# EAGLE design pro-one-oscillators-with-connectors-version2 (EAGLE 5.07)
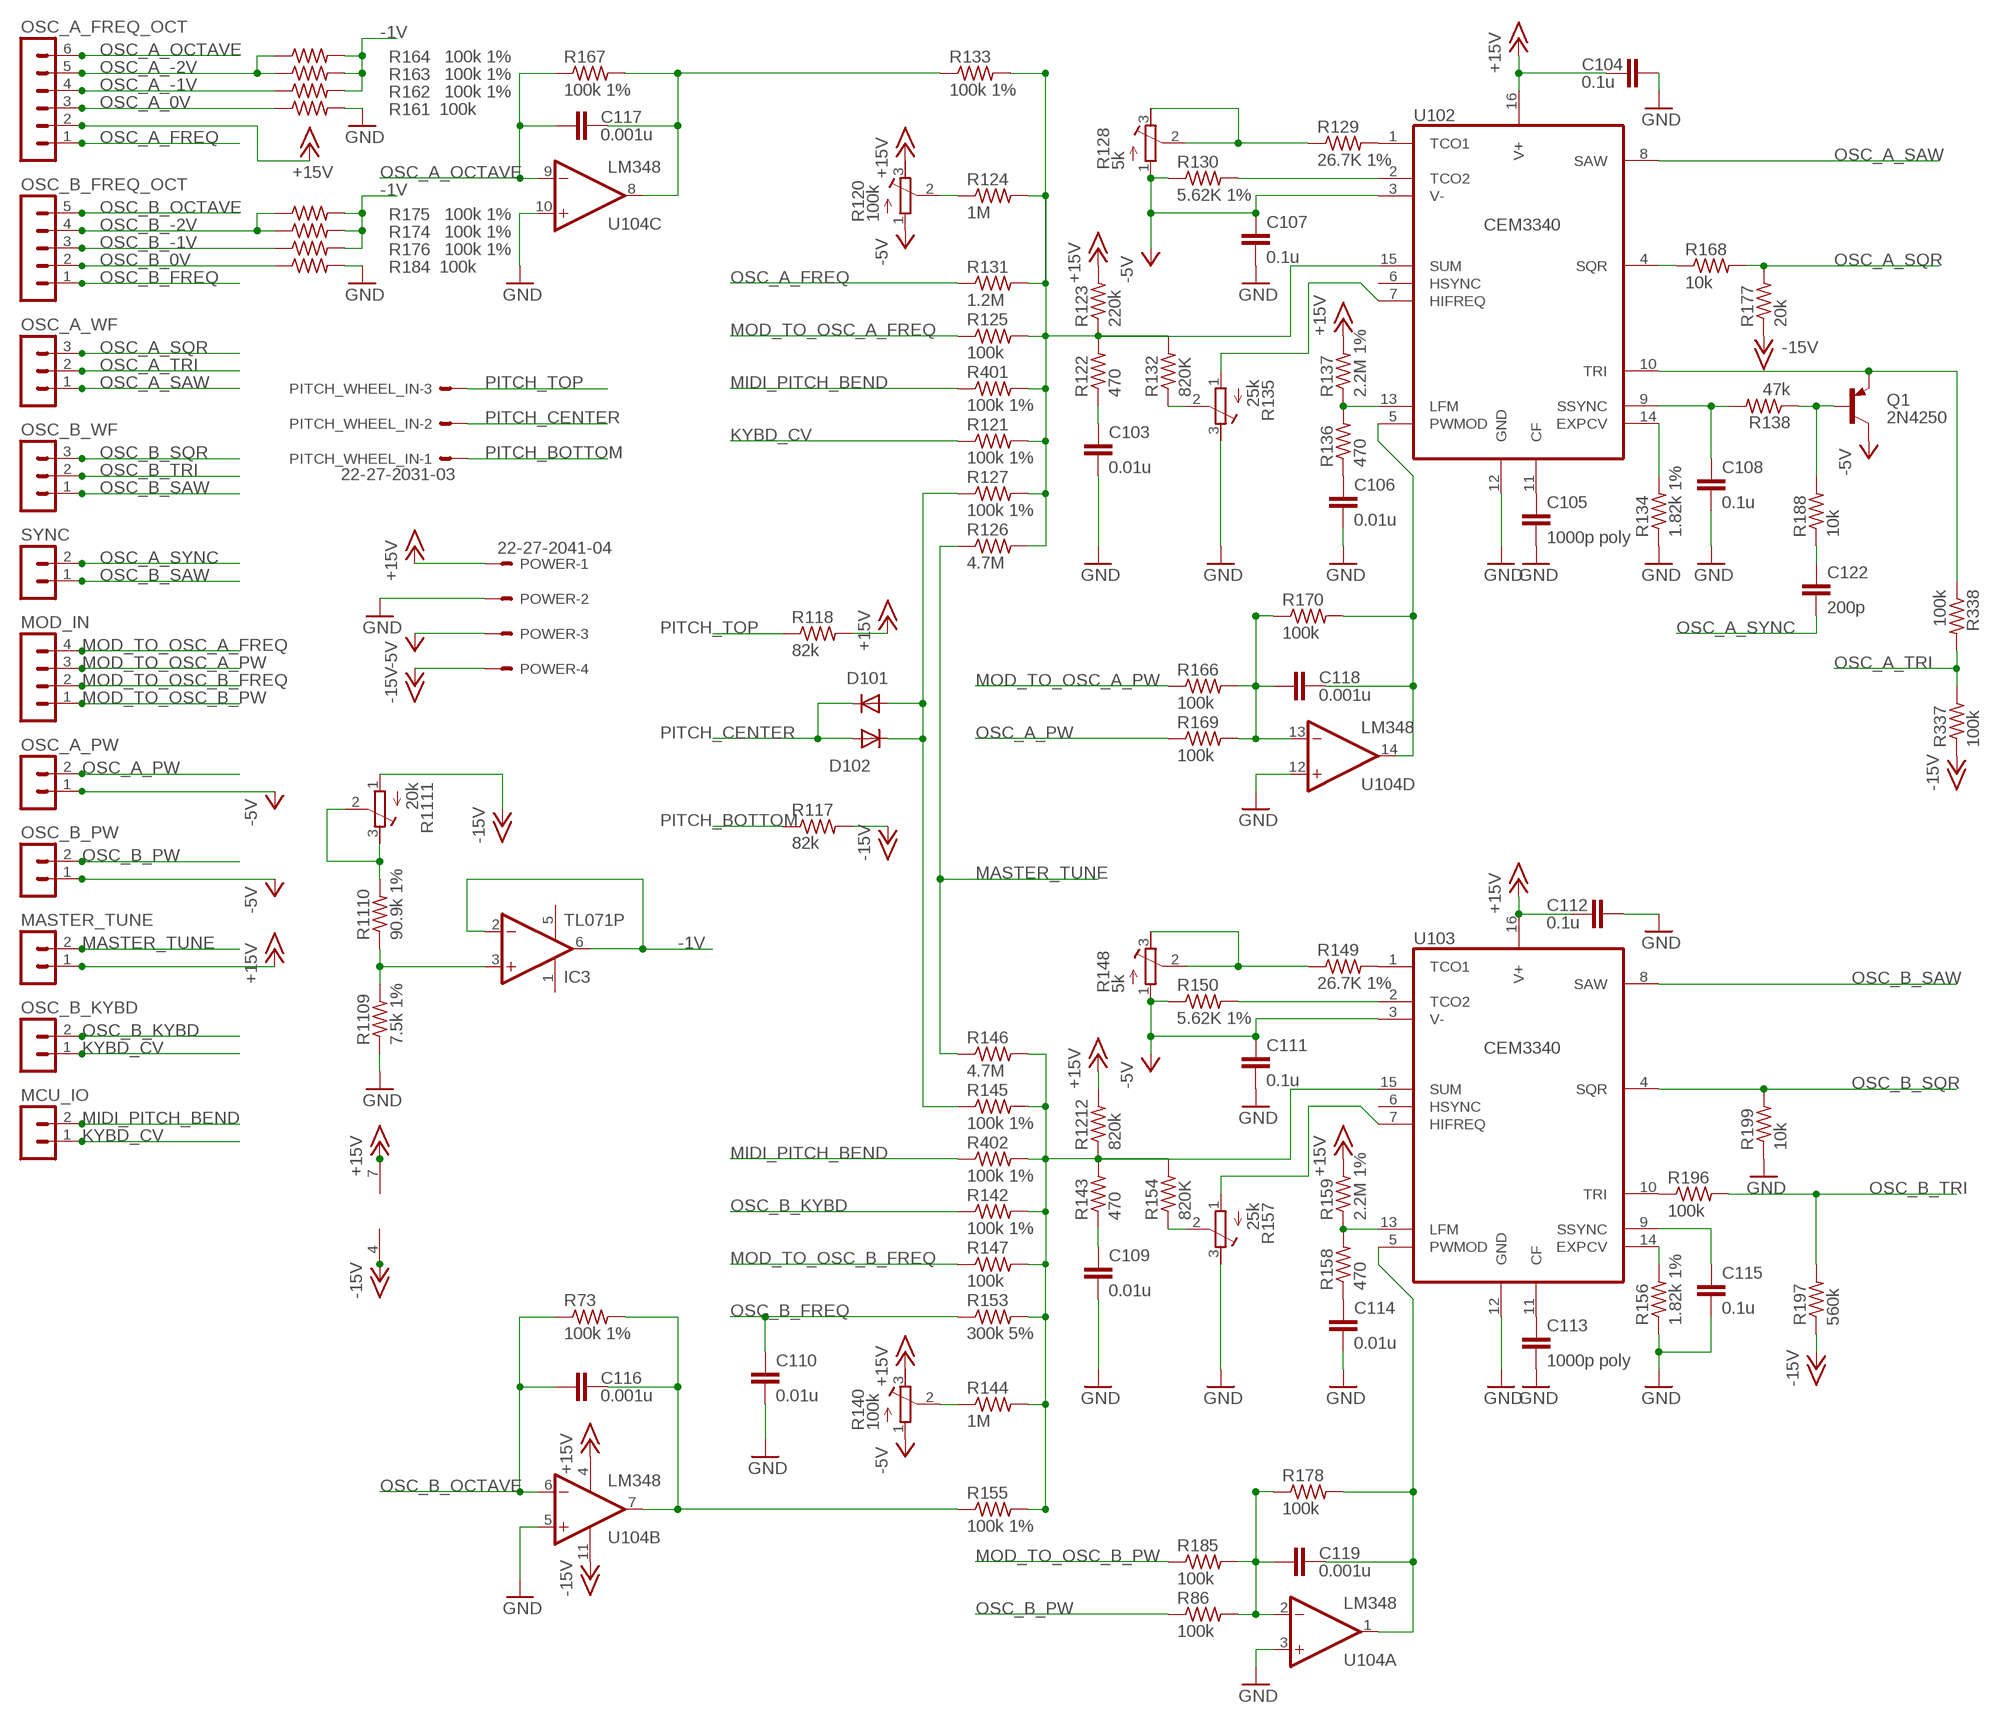
[diagram p0: schematic, sheet 1]

## Parts
C103  0.01u  C-EU050-025X075  [C050-025X075]
C104  0.1u  C-EU050-025X075  [C050-025X075]
C105  1000p poly  C-EU050-025X075  [C050-025X075]
C106  0.01u  C-EU050-025X075  [C050-025X075]
C107  0.1u  C-EU050-025X075  [C050-025X075]
C108  0.1u  C-EU050-025X075  [C050-025X075]
C109  0.01u  C-EU050-025X075  [C050-025X075]
C110  0.01u  C-EU050-025X075  [C050-025X075]
C111  0.1u  C-EU050-025X075  [C050-025X075]
C112  0.1u  C-EU050-025X075  [C050-025X075]
C113  1000p poly  C-EU050-025X075  [C050-025X075]
C114  0.01u  C-EU050-025X075  [C050-025X075]
C115  0.1u  C-EU050-025X075  [C050-025X075]
C116  0.001u  C-EU050-025X075  [C050-025X075]
C117  0.001u  C-EU050-025X075  [C050-025X075]
C118  0.001u  C-EU050-025X075  [C050-025X075]
C119  0.001u  C-EU050-025X075  [C050-025X075]
C122  200p  C-EU050-025X075  [C050-025X075]
D101  1N4148DO35-7  [DO35-7]
D102  1N4148DO35-7  [DO35-7]
IC3  TL071P  [DIL08]
MASTER_TUNE  MA02-1  [MA02-1]
MCU_IO  MA02-1  [MA02-1]
MOD_IN  MA04-1  [MA04-1]
OSC_A_FREQ_OCT  MA06-1  [MA06-1]
OSC_A_PW  MA02-1  [MA02-1]
OSC_A_WF  MA03-1  [MA03-1]
OSC_B_FREQ_OCT  MA05-1  [MA05-1]
OSC_B_KYBD  MA02-1  [MA02-1]
OSC_B_PW  MA02-1  [MA02-1]
OSC_B_WF  MA03-1  [MA03-1]
PITCH_WHEEL_IN  22-27-2031-03  [6410-03]
POWER  22-27-2041-04  [6410-04]
Q1  2N4250  [TO92]
R73  100k 1%  R-US_0309/10  [0309/10]
R86  100k  R-US_0309/10  [0309/10]
R117  82k  R-US_0309/10  [0309/10]
R118  82k  R-US_0309/10  [0309/10]
R120  100k  R-TRIMM64W  [RTRIM64W]
R121  100k 1%  R-US_0309/10  [0309/10]
R122  470  R-US_0309/10  [0309/10]
R123  220k  R-US_0309/10  [0309/10]
R124  1M  R-US_0309/10  [0309/10]
R125  100k  R-US_0309/10  [0309/10]
R126  4.7M  R-US_0309/10  [0309/10]
R127  100k 1%  R-US_0309/10  [0309/10]
R128  5k  R-TRIMM64W  [RTRIM64W]
R129  26.7K 1%  R-US_0309/10  [0309/10]
R130  5.62K 1%  R-US_0309/10  [0309/10]
R131  1.2M  R-US_0309/10  [0309/10]
R132  820K  R-US_0309/10  [0309/10]
R133  100k 1%  R-US_0309/10  [0309/10]
R134  1.82k 1%  R-US_0309/10  [0309/10]
R135  25k  R-TRIMM64W  [RTRIM64W]
R136  470  R-US_0309/10  [0309/10]
R137  2.2M 1%  R-US_0309/10  [0309/10]
R138  47k  R-US_0207/2V  [0207/2V]
R140  100k  R-TRIMM64W  [RTRIM64W]
R142  100k 1%  R-US_0309/10  [0309/10]
R143  470  R-US_0309/10  [0309/10]
R144  1M  R-US_0309/10  [0309/10]
R145  100k 1%  R-US_0207/2V  [0207/2V]
R146  4.7M  R-US_0309/10  [0309/10]
R147  100k  R-US_0309/10  [0309/10]
R148  5k  R-TRIMM64W  [RTRIM64W]
R149  26.7K 1%  R-US_0309/10  [0309/10]
R150  5.62K 1%  R-US_0309/10  [0309/10]
R153  300k 5%  R-US_0309/10  [0309/10]
R154  820K  R-US_0309/10  [0309/10]
R155  100k 1%  R-US_0309/10  [0309/10]
R156  1.82k 1%  R-US_0309/10  [0309/10]
R157  25k  R-TRIMM64W  [RTRIM64W]
R158  470  R-US_0309/10  [0309/10]
R159  2.2M 1%  R-US_0309/10  [0309/10]
R161  100k  R-US_0309/10  [0309/10]
R162  100k 1%  R-US_0309/10  [0309/10]
R163  100k 1%  R-US_0309/10  [0309/10]
R164  100k 1%  R-US_0309/10  [0309/10]
R166  100k  R-US_0309/10  [0309/10]
R167  100k 1%  R-US_0309/10  [0309/10]
R168  10k  R-US_0309/10  [0309/10]
R169  100k  R-US_0309/10  [0309/10]
R170  100k  R-US_0309/10  [0309/10]
R174  100k 1%  R-US_0309/10  [0309/10]
R175  100k 1%  R-US_0309/10  [0309/10]
R176  100k 1%  R-US_0309/10  [0309/10]
R177  20k  R-US_0309/10  [0309/10]
R178  100k  R-US_0309/10  [0309/10]
R184  100k  R-US_0309/10  [0309/10]
R185  100k  R-US_0309/10  [0309/10]
R188  10k  R-US_0309/10  [0309/10]
R196  100k  R-US_0309/10  [0309/10]
R197  560k  R-US_0309/10  [0309/10]
R199  10k  R-US_0309/10  [0309/10]
R337  100k  R-US_0309/10  [0309/10]
R338  100k  R-US_0309/10  [0309/10]
R401  100k 1%  R-US_0309/10  [0309/10]
R402  100k 1%  R-US_0309/10  [0309/10]
R1109  7.5k 1%  R-US_0309/10  [0309/10]
R1110  90.9k 1%  R-US_0309/10  [0309/10]
R1111  20k  R-TRIMM64W  [RTRIM64W]
R1212  820k  R-US_0309/10  [0309/10]
SYNC  MA02-1  [MA02-1]
U102  CEM3340  [DIL16]
U103  CEM3340  [DIL16]
U104  LM348  [DIL14]

## Nets
+15V: C104.1 C112.1 IC3.7(V+) MASTER_TUNE.1 OSC_A_FREQ_OCT.2 POWER.1 R118.2 R120.3(A) R123.2 R137.2 R140.3(A) R159.2 R1212.2 U102.16(V+) U103.16(V+) U104.4(P:V+)
-1V: IC3.2(-IN) IC3.6(OUT) R162.2 R163.2 R164.2 R174.2 R175.2 R176.2
-5V: C107.1 C111.1 OSC_A_PW.1 OSC_B_PW.1 POWER.3 Q1.1(C) R120.1(E) R128.1(E) R130.1 R140.1(E) R148.1(E) R150.1 U102.3(V-) U103.3(V-)
-15V: IC3.4(V-) POWER.4 R117.2 R177.1 R197.1 R337.1 R1111.1(E) U104.11(P:V-)
GND: C103.2 C104.2 C105.2 C106.2 C107.2 C108.2 C109.2 C110.2 C111.2 C112.2 C113.2 C114.2 C115.2 POWER.2 R134.1 R135.3(A) R156.1 R157.3(A) R161.2 R184.2 R199.1 R1109.1 U102.12(GND) U103.12(GND) U104.3(A:+IN) U104.5(B:+IN) U104.10(C:+IN) U104.12(D:+IN)
KYBD_CV: MCU_IO.1 OSC_B_KYBD.1 R121.1
MASTER_TUNE: MASTER_TUNE.2 R126.1 R146.1
MIDI_PITCH_BEND: MCU_IO.2 R401.1 R402.1
MOD_TO_OSC_A_FREQ: MOD_IN.4 R125.1
MOD_TO_OSC_A_PW: MOD_IN.3 R166.1
MOD_TO_OSC_B_FREQ: MOD_IN.2 R147.1
MOD_TO_OSC_B_PW: MOD_IN.1 R185.1
N$1: R129.2 U102.1(TCO1)
N$2: R130.2 U102.2(TCO2)
N$3: R136.2 R137.1 U102.13(LFM)
N$4: R121.2 R122.2 R123.1 R124.2 R125.2 R126.2 R127.2 R131.2 R132.2 R133.2 R401.2 U102.15(SUM)
N$5: R128.2(S) R128.3(A) R129.1
N$6: C106.1 R136.1
N$7: C108.1 R138.2 U102.9(SSYNC)
N$8: R135.1(E) U102.7(HIFREQ)
N$9: R132.1 R135.2(S)
N$10: C103.1 R122.1
N$11: C105.1 U102.11(CF)
N$12: R134.2 U102.14(EXPCV)
N$13: R168.1 U102.4(SQR)
N$14: R142.2 R143.2 R144.2 R145.2 R146.2 R147.2 R153.2 R154.2 R155.2 R402.2 R1212.1 U103.15(SUM)
N$15: R149.2 U103.1(TCO1)
N$16: R150.2 U103.2(TCO2)
N$17: R158.2 R159.1 U103.13(LFM)
N$18: IC3.3(+IN) R1109.2 R1110.1
N$19: R148.2(S) R148.3(A) R149.1
N$20: R157.1(E) U103.7(HIFREQ)
N$21: R154.1 R157.2(S)
N$22: C114.1 R158.1
N$23: C109.1 R143.1
N$24: R156.2 U103.14(EXPCV)
N$26: R1110.2 R1111.2(S) R1111.3(A)
N$27: C115.1 U103.9(SSYNC)
N$28: C113.1 U103.11(CF)
N$30: R140.2(S) R144.1
N$31: D101.A D102.C R127.1 R145.1
N$34: C118.2 R170.2 U102.5(PWMOD) U104.14(D:OUT)
N$36: C118.1 R166.2 R169.2 R170.1 U104.13(D:-IN)
N$38: C119.1 R86.2 R178.1 R185.2 U104.2(A:-IN)
N$39: C119.2 R178.2 U103.5(PWMOD) U104.1(A:OUT)
N$40: C116.2 R73.2 R155.1 U104.7(B:OUT)
N$43: R120.2(S) R124.1
N$46: C117.2 R133.1 R167.2 U104.8(C:OUT)
N$52: Q1.2(B) R138.1 R188.2
N$54: Q1.3(E) R338.1 U102.10(TRI)
N$61: C122.1 R188.1
N$64: R196.1 U103.10(TRI)
OSC_A_0V: OSC_A_FREQ_OCT.3 R161.1
OSC_A_-1V: OSC_A_FREQ_OCT.4 R162.1
OSC_A_-2V: OSC_A_FREQ_OCT.5 R163.1 R164.1
OSC_A_FREQ: OSC_A_FREQ_OCT.1 R131.1
OSC_A_OCTAVE: C117.1 OSC_A_FREQ_OCT.6 R167.1 U104.9(C:-IN)
OSC_A_PW: OSC_A_PW.2 R169.1
OSC_A_SAW: OSC_A_WF.1 U102.8(SAW)
OSC_A_SQR: OSC_A_WF.3 R168.2 R177.2
OSC_A_SYNC: C122.2 SYNC.2
OSC_A_TRI: OSC_A_WF.2 R337.2 R338.2
OSC_B_0V: OSC_B_FREQ_OCT.2 R184.1
OSC_B_-1V: OSC_B_FREQ_OCT.3 R176.1
OSC_B_-2V: OSC_B_FREQ_OCT.4 R174.1 R175.1
OSC_B_FREQ: C110.1 OSC_B_FREQ_OCT.1 R153.1
OSC_B_KYBD: OSC_B_KYBD.2 R142.1
OSC_B_OCTAVE: C116.1 OSC_B_FREQ_OCT.5 R73.1 U104.6(B:-IN)
OSC_B_PW: OSC_B_PW.2 R86.1
OSC_B_SAW: OSC_B_WF.1 SYNC.1 U103.8(SAW)
OSC_B_SQR: OSC_B_WF.3 R199.2 U103.4(SQR)
OSC_B_TRI: OSC_B_WF.2 R196.2 R197.2
PITCH_BOTTOM: PITCH_WHEEL_IN.1 R117.1
PITCH_CENTER: D101.C D102.A PITCH_WHEEL_IN.2
PITCH_TOP: PITCH_WHEEL_IN.3 R118.1
Unconnected: IC3.1(OFFSET_N1) IC3.5(OFFSET_N2) U102.6(HSYNC) U103.6(HSYNC)

## Library data of the parts
C103-C119 C122 = resistor:C-EU: CAPACITOR, European symbol
D101 D102 = diode:1N4148: DIODE high speed (Philips)
IC3 = joakim:TL071: OP AMP
MASTER_TUNE MCU_IO OSC_A_PW OSC_B_KYBD OSC_B_PW SYNC = joakim:MA02-1: PIN HEADER
MOD_IN = con-lstb:MA04-1: PIN HEADER
OSC_A_FREQ_OCT = con-lstb:MA06-1: PIN HEADER
OSC_A_WF OSC_B_WF = con-lstb:MA03-1: PIN HEADER
OSC_B_FREQ_OCT = con-lstb:MA05-1: PIN HEADER
PITCH_WHEEL_IN = con-molex:22-?-03: CONNECTOR wire to board 2.54 mm (.1 inch) pitch header
POWER = con-molex:22-?-04: CONNECTOR wire to board 2.54 mm (.1 inch) pitch header
Q1 = joakim:2N4250: PNP Transistor
R73 R86 R117 R118 R121-R127 R129-R134 R136-R138 R142-R147 R149 R150 R153-R156 R158 R159 R161-R164 R166-R170 R174-R178 R184 R185 R188 R196 R197 R199 R337 R338 R401 R402 R1109 R1110 R1212 = resistor:R-US_: RESISTOR, American symbol
R120 R128 R135 R140 R148 R157 R1111 = resistor:R-TRIMM: Trimm resistor
U102 U103 = joakim:CEM3340: Voltage Controlled Oscillator for musical synthesizers
U104 = joakim:LM348: Quad General Purpose, Low Voltage, Operational Amplifiers

## Board
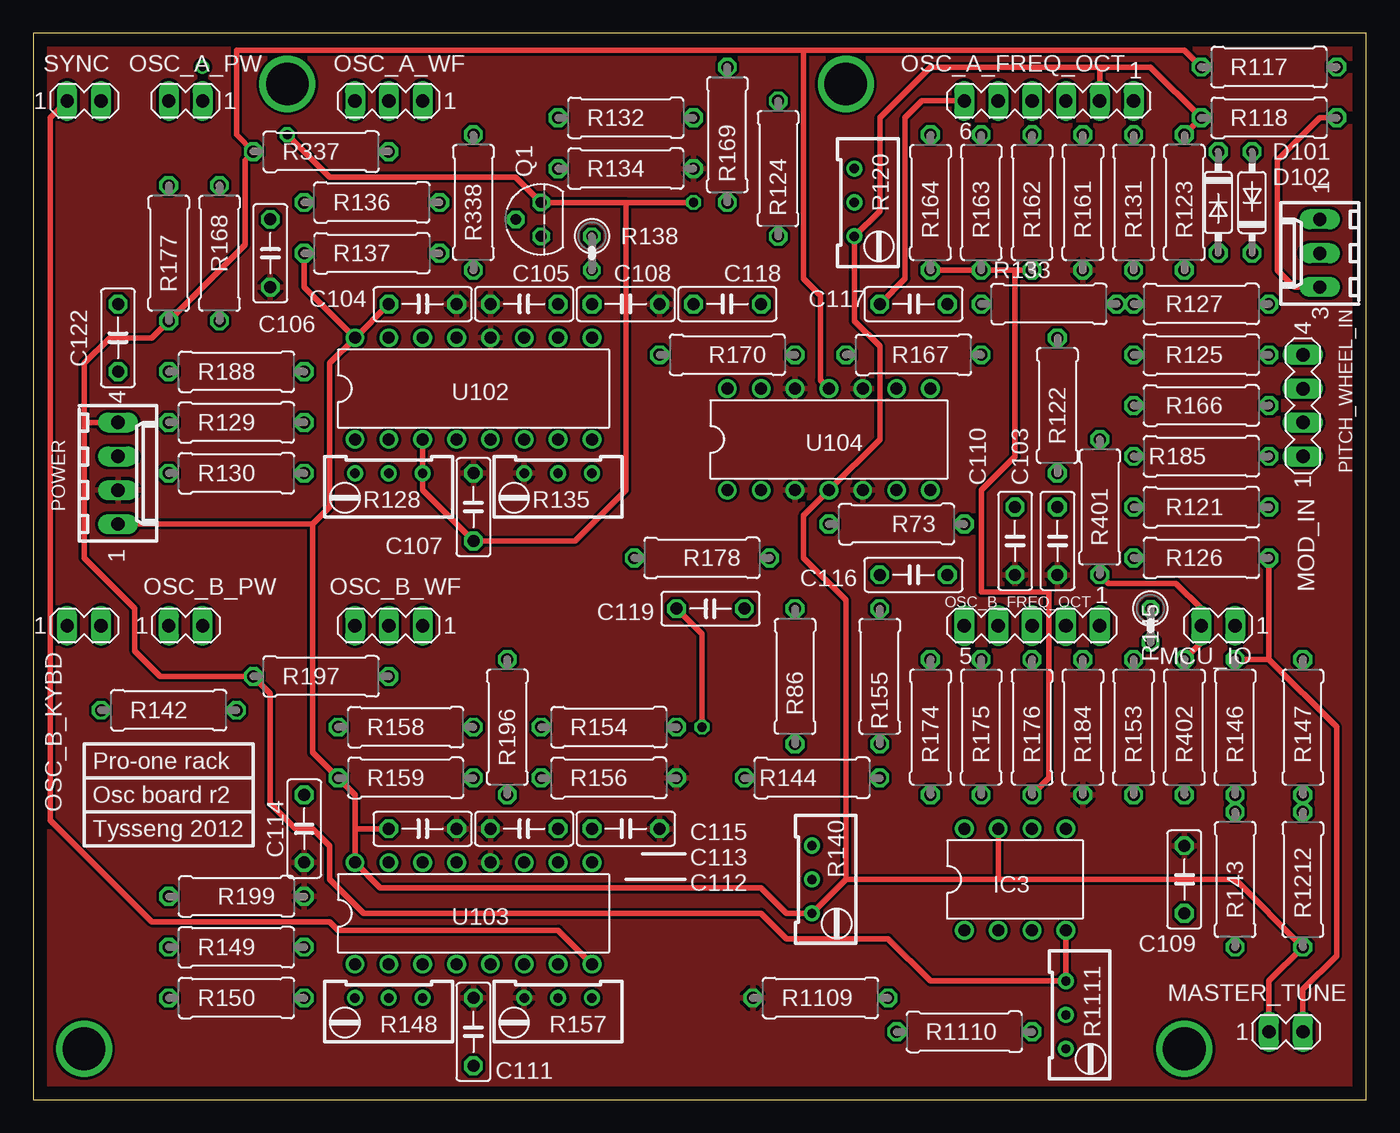
[diagram p1: board, top side]
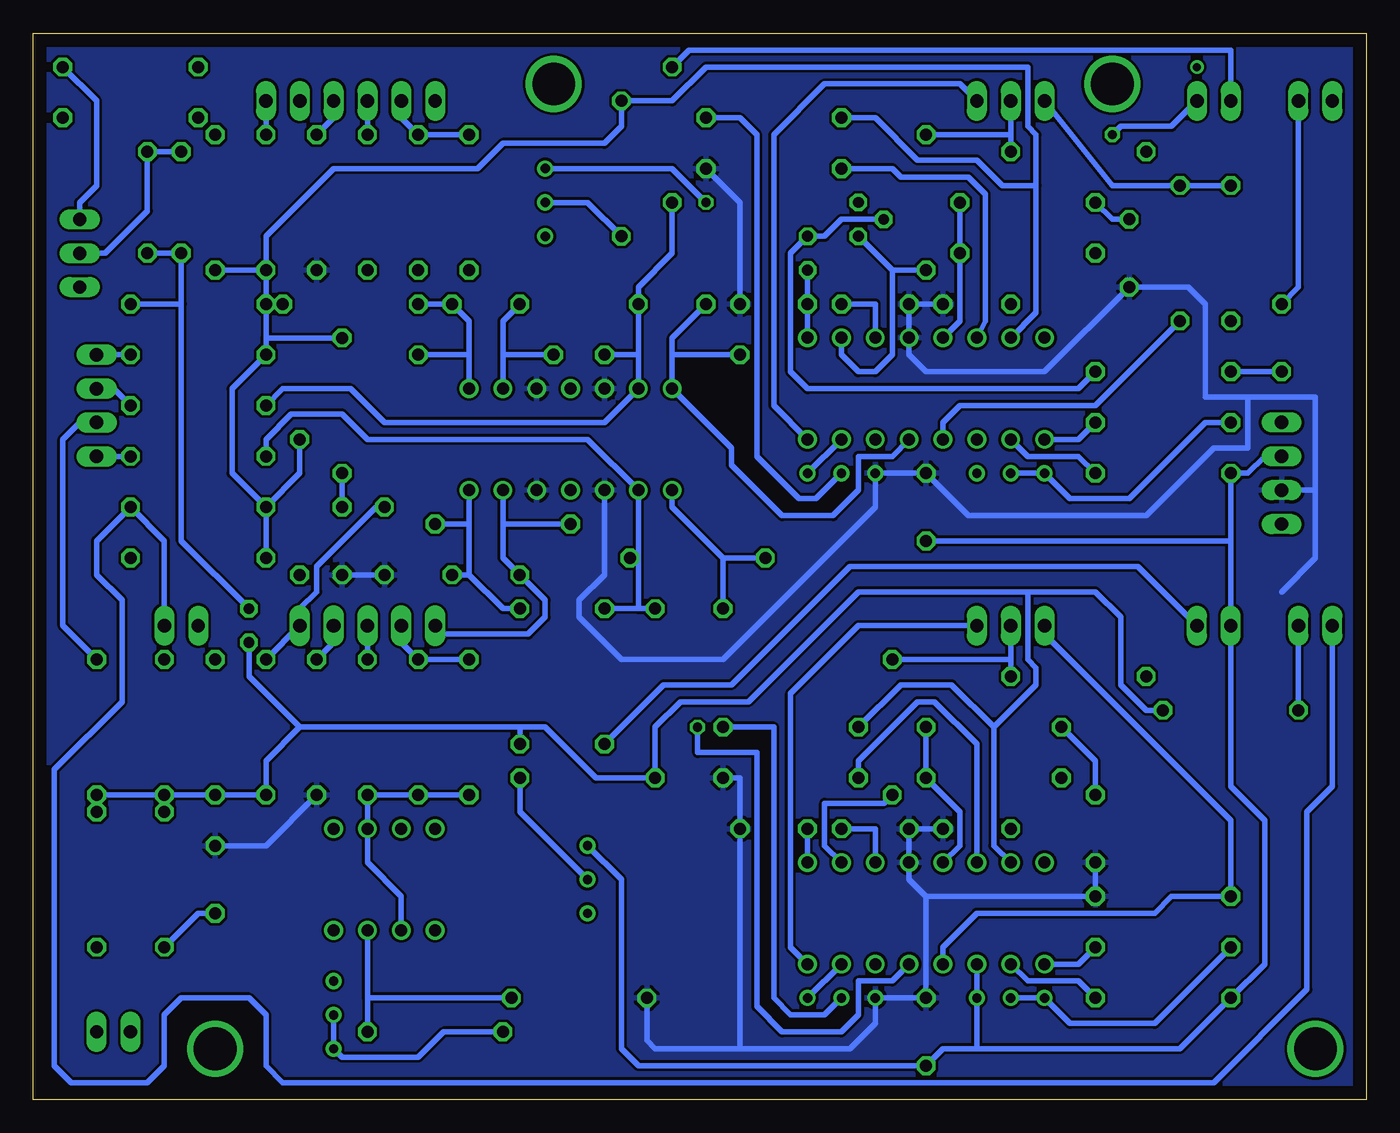
[diagram p2: board, bottom side, seen from below]

Size 100 x 80 mm. Coordinates in mm from the lower left corner, seen from the top.
Outline: 0,0 100,0 100,80 0,80 0,0
Copper layers (1*16): Top 0.035mm / dielectric 1.5mm / Bottom 0.035mm
Design rules "default": minimum track width 10mil, minimum drill 24mil, track to track 8mil, track to pad 8mil, pad to pad 8mil, via to via 8mil, smd to smd 8mil, copper to edge 40mil, drill to drill 8mil, minimum pad ring 10mil, minimum via ring 8mil, stop-mask expansion 4mil, vias tented up to drill 0mil, thermal gap 10mil

### Footprints (pad centres in the part's own frame; a part is rotated, then mirrored left to right if it is on the bottom)
C050-025X075 = drill 0.9 octagon: 1 -2.54,0; 2 2.54,0
DO35-7 = drill 0.9 octagon: A 3.81,0; C -3.81,0
DIL08 = drill 0.9 round: 1 -3.81,-3.81; 2 -1.27,-3.81; 3 1.27,-3.81; 4 3.81,-3.81; 5 3.81,3.81; 6 1.27,3.81; 7 -1.27,3.81; 8 -3.81,3.81
MA02-1 = drill 1 long: 1 -2.54,0; 2 0,0
MA04-1 = drill 1.016 long: 1 -3.81,0; 2 -1.27,0; 3 1.27,0; 4 3.81,0
MA06-1 = drill 1 long: 1 -6.35,0; 2 -3.81,0; 3 -1.27,0; 4 1.27,0; 5 3.81,0; 6 6.35,0
MA03-1 = drill 1 long: 1 -2.54,0; 2 0,0; 3 2.54,0
MA05-1 = drill 1.016 long: 1 -5.08,0; 2 -2.54,0; 3 0,0; 4 2.54,0; 5 5.08,0
6410-03 = drill 1 long: 1 2.54,0; 2 0,0; 3 -2.54,0
6410-04 = drill 1 long: 1 3.81,0; 2 1.27,0; 3 -1.27,0; 4 -3.81,0
TO92 = drill 0.813 octagon: 1 1.27,0; 2 0,1.905; 3 -1.27,0
0309/10 = drill 0.9 octagon: 1 -5.08,0; 2 5.08,0
RTRIM64W = drill 0.7 round: 1 1.27,-2.54; 2 1.27,0; 3 1.27,2.54
0207/2V = drill 0.813 octagon: 1 -1.27,0; 2 1.27,0
DIL16 = drill 0.9 round: 1 -8.89,-3.81; 2 -6.35,-3.81; 3 -3.81,-3.81; 4 -1.27,-3.81; 5 1.27,-3.81; 6 3.81,-3.81; 7 6.35,-3.81; 8 8.89,-3.81; 9 8.89,3.81; 10 6.35,3.81; 11 3.81,3.81; 12 1.27,3.81; 13 -1.27,3.81; 14 -3.81,3.81; 15 -6.35,3.81; 16 -8.89,3.81
DIL14 = drill 0.9 round: 1 -7.62,-3.81; 2 -5.08,-3.81; 3 -2.54,-3.81; 4 0,-3.81; 5 2.54,-3.81; 6 5.08,-3.81; 7 7.62,-3.81; 8 7.62,3.81; 9 5.08,3.81; 10 2.54,3.81; 11 0,3.81; 12 -2.54,3.81; 13 -5.08,3.81; 14 -7.62,3.81

### Placement (x,y rotation side)
C103  76.83,41.91 270 top
C104  29.21,59.69 0 top
C105  36.83,59.69 180 top
C106  17.78,63.5 270 top
C107  33.02,44.45 90 top
C108  44.45,59.69 0 top
C109  86.36,16.51 90 top
C110  73.66,41.91 270 top
C111  33.02,5.08 90 top
C112  29.21,20.32 0 top
C113  36.83,20.32 180 top
C114  20.32,20.32 270 top
C115  44.45,20.32 0 top
C116  66.04,39.37 0 top
C117  66.04,59.69 0 top
C118  52.07,59.69 180 top
C119  50.8,36.83 180 top
C122  6.35,57.15 90 top
D101  88.9,67.31 270 top
D102  91.44,67.31 90 top
IC3  73.66,16.51 0 top
MASTER_TUNE  95.25,5.08 0 top
MCU_IO  87.63,35.56 180 top
MOD_IN  95.25,52.07 90 top
OSC_A_FREQ_OCT  76.2,74.93 180 top
OSC_A_PW  10.16,74.93 180 top
OSC_A_WF  26.67,74.93 180 top
OSC_B_FREQ_OCT  74.93,35.56 180 top
OSC_B_KYBD  5.08,35.56 0 top
OSC_B_PW  12.7,35.56 0 top
OSC_B_WF  26.67,35.56 180 top
PITCH_WHEEL_IN  96.52,63.5 90 top
POWER  6.35,46.99 270 top
Q1  38.1,66.04 90 top
R73  64.77,43.18 0 top
R86  57.15,31.75 90 top
R117  92.71,77.47 180 top
R118  92.71,73.66 180 top
R120  62.87,67.31 180 top
R121  87.63,44.45 180 top
R122  76.83,52.07 90 top
R123  86.36,67.31 90 top
R124  55.88,69.85 90 top
R125  87.63,55.88 180 top
R126  87.63,40.64 180 top
R127  87.63,59.69 180 top
R128  26.67,45.72 90 top
R129  15.24,50.8 0 top
R130  15.24,46.99 0 top
R131  82.55,67.31 270 top
R132  44.45,73.66 180 top
R133  76.2,59.69 0 top
R134  44.45,69.85 180 top
R135  39.37,45.72 90 top
R136  25.4,67.31 0 top
R137  25.4,63.5 180 top
R138  41.91,63.5 270 top
R140  59.69,16.51 180 top
R142  10.16,29.21 0 top
R143  90.17,16.51 90 top
R144  58.42,24.13 180 top
R145  83.82,35.56 270 top
R146  90.17,27.94 270 top
R147  95.25,27.94 270 top
R148  26.67,6.35 90 top
R149  15.24,11.43 0 top
R150  15.24,7.62 0 top
R153  82.55,27.94 270 top
R154  43.18,27.94 180 top
R155  63.5,31.75 270 top
R156  43.18,24.13 180 top
R157  39.37,6.35 90 top
R158  27.94,27.94 0 top
R159  27.94,24.13 180 top
R161  78.74,67.31 270 top
R162  74.93,67.31 270 top
R163  71.12,67.31 270 top
R164  67.31,67.31 270 top
R166  87.63,52.07 180 top
R167  66.04,55.88 0 top
R168  13.97,63.5 90 top
R169  52.07,72.39 270 top
R170  52.07,55.88 180 top
R174  67.31,27.94 270 top
R175  71.12,27.94 270 top
R176  74.93,27.94 270 top
R177  10.16,63.5 90 top
R178  50.16,40.64 180 top
R184  78.74,27.94 270 top
R185  87.63,48.26 180 top
R188  15.24,54.61 0 top
R196  35.56,27.94 90 top
R197  21.59,31.75 0 top
R199  15.24,15.24 180 top
R337  21.59,71.12 0 top
R338  33.02,67.31 90 top
R401  80.01,44.45 90 top
R402  86.36,27.94 270 top
R1109  59.05,7.62 0 top
R1110  69.85,5.08 180 top
R1111  78.74,6.35 180 top
R1212  95.25,16.51 270 top
SYNC  5.08,74.93 0 top
U102  33.02,53.34 0 top
U103  33.02,13.97 0 top
U104  59.69,49.53 0 top

### Tracks (layer width: path | path; a pad name or v marks a point on that pad's centre or on a via)
+15V
  Top 0.406: 20.95,43.18 20.95,26.04 R159.2 24.13,22.86 24.13,20.32 | 20.95,43.18 POWER.1 | 24.13,20.32 U103.16 26.04,15.88 54.61,15.88 56.52,13.97 R140.3 60.96,16.51 | 24.13,20.32 C112.1 | 60.96,16.51 72.39,16.51 | 72.39,16.51 IC3.7 | 60.96,16.51 60.96,37.47 57.78,40.64 57.78,43.81 U104.4 63.5,49.53 63.5,56.52 61.59,58.42 R120.3 63.5,66.67 63.5,73.66 67.31,77.47 80.01,77.47 | 72.39,16.51 90.17,16.51 R1212.2 92.71,8.89 MASTER_TUNE.1 | 20.95,43.18 22.23,44.45 22.23,55.24 U102.16 | U102.16 C104.1 | U102.16 20.32,60.96 R137.2 | 80.01,77.47 OSC_A_FREQ_OCT.2 | 80.01,77.47 83.82,77.47 R118.2 R123.2
-1V
  Top 0.406: 73.66,62.23 73.66,48.26 71.12,45.72 71.12,38.1 76.2,38.1 76.2,24.13 R176.2 | 73.66,62.23 R162.2 | R164.2 R163.2 73.66,62.23
  Bottom 0.406: IC3.2 72.39,15.24 74.93,17.78 IC3.6 R176.2 R175.2 R174.2
-5V  (via drill 0.7)
  Top 0.406: 44.45,67.31 v49.53,67.31 | v19.05,72.39 22.23,69.22 36.2,69.22 Q1.1 44.45,67.31 | 44.45,67.31 44.45,45.72 40.64,41.91 C107.1 29.21,45.72 R128.1 U102.3
  Bottom 0.406: 29.21,3.81 13.97,3.81 R150.1 7.62,10.16 7.62,20.95 10.16,23.5 OSC_B_PW.1 10.16,41.91 | 29.21,3.81 R148.1 U103.3 | 29.21,3.81 31.75,3.81 C111.1 54.61,2.54 55.88,3.81 55.88,16.51 R140.1 | 10.16,41.91 R130.1 8.89,46.99 7.62,48.26 POWER.3 | v49.53,67.31 52.07,69.85 R120.1 | 10.16,41.91 C107.1 | v19.05,72.39 18.41,73.03 14.61,73.03 OSC_A_PW.1
-15V
  Top 0.406: R117.2 86.36,78.74 57.78,78.74 | 57.78,78.74 15.24,78.74 15.24,72.39 R337.1 15.88,70.48 15.88,64.14 R177.1 8.89,57.15 5.71,57.15 3.81,55.24 3.81,50.8 | U104.11 59.05,53.98 59.05,60.33 57.78,61.59 57.78,78.74 | 3.81,50.8 POWER.4 | 3.81,50.8 3.81,40.64 7.62,36.83 7.62,33.66 9.53,31.75 R197.1 17.78,30.48 17.78,22.23 19.68,20.32 20.95,20.32 22.23,19.05 22.23,16.51 24.77,13.97 54.61,13.97 56.52,12.06 64.14,12.06 67.31,8.89 R1111.1 IC3.4
GND
  Bottom 0.406: R156.1 46.99,24.13 C115.2 46.99,3.81 | C112.2 C113.2 U103.12 34.29,16.51 33.02,15.24 | 33.02,15.24 R199.1 C114.2 | 33.02,15.24 C111.2 R157.3 36.83,5.71 38.73,3.81 46.99,3.81 | C109.2 82.55,19.05 R184.2 | C104.2 C105.2 U102.12 34.29,55.88 33.02,54.61 24.13,54.61 C106.2 13.34,60.96 12.06,59.69 12.06,52.7 8.89,52.7 | C108.2 46.99,67.31 R134.1 | 8.89,52.7 3.81,52.7 3.81,45.72 | 46.99,3.81 53.34,3.81 53.98,4.45 R1109.1 | C110.2 C103.2 | U104.3 57.15,39.37 59.05,37.47 59.05,36.2 55.88,33.02 48.26,33.02 36.83,44.45 R135.3 C107.2 29.84,43.81 16.51,43.81 11.43,48.9 8.89,48.9 8.89,52.7 | 3.81,45.72 3.81,40.64 6.35,38.1 | 3.81,45.72 POWER.2
  pour Bottom: 0.64,79.38 99.69,79.38 99.69,0.64 0.64,0.64
  pour Top: 0.64,79.38 99.69,79.38 99.69,0.64 0.64,0.64
KYBD_CV
  Bottom 0.406: MCU_IO.1 90.17,41.91 R121.1 95.25,41.91 95.25,39.37 93.34,37.47 93.34,29.84 98.42,24.77 98.42,2.54 97.16,1.27 91.44,1.27 90.17,2.54 90.17,6.35 88.9,7.62 83.82,7.62 82.55,6.35 82.55,2.54 81.28,1.27 11.43,1.27 4.45,8.26 4.45,21.59 2.54,23.5 OSC_B_KYBD.1
MASTER_TUNE
  Top 0.406: 92.71,33.02 R126.1 | 92.71,33.02 R146.1 | MASTER_TUNE.2 95.25,8.26 97.79,10.79 97.79,27.94 92.71,33.02
MIDI_PITCH_BEND
  Top 0.406: R401.1 80.64,38.73 85.72,38.73 87.63,36.83 MCU_IO.2 87.63,34.29 R402.1
MOD_TO_OSC_A_FREQ
  Bottom 0.406: R125.1 MOD_IN.4
MOD_TO_OSC_A_PW
  Bottom 0.406: R166.1 93.98,53.34 MOD_IN.3
MOD_TO_OSC_B_FREQ
  Bottom 0.406: R147.1 97.79,35.56 97.79,49.53 96.52,50.8 MOD_IN.2
MOD_TO_OSC_B_PW
  Bottom 0.406: R185.1 MOD_IN.1
N$1
  Bottom 0.406: R129.2 21.59,49.53 U102.1
N$2
  Bottom 0.406: U102.2 25.4,48.26 21.59,48.26 R130.2
N$3
  Bottom 0.406: R136.2 R137.1 30.48,58.42 U102.13
N$4
  Bottom 0.406: R121.2 85.09,46.99 85.09,53.34 R125.2 R127.2 | R131.2 R127.2 | R121.2 R126.2 | U102.15 24.77,59.05 24.77,68.58 | R132.2 36.83,73.66 33.66,70.48 29.21,70.48 27.3,68.58 24.77,68.58 | 24.77,68.58 24.77,72.39 25.4,73.03 25.4,77.47 49.53,77.47 52.07,74.93 R124.2 55.88,73.03 57.15,71.75 64.77,71.75 66.67,69.85 77.47,69.85 82.55,64.77 R131.2 | R131.2 R123.1 | R127.2 82.55,57.15 R122.2 | R401.2 80.01,46.99 R121.2 | R127.2 R133.2
N$5
  Bottom 0.406: R129.1 12.06,50.8 17.78,45.09 22.23,45.09 R128.3 R128.2
N$6
  Bottom 0.406: C106.1 19.05,66.04 R136.1
N$7
  Bottom 0.406: U102.9 C108.1 R138.2
N$8
  Bottom 0.406: R135.1 U102.7
N$9
  Bottom 0.406: R135.2 41.27,45.09 42.55,45.09 45.72,48.26 45.72,72.39 46.99,73.66 R132.1
N$10
  Bottom 0.406: C103.1 R122.1
N$11
  Bottom 0.406: C105.1 36.83,59.69 U102.11
N$12
  Bottom 0.406: R134.2 35.56,69.85 34.92,69.22 29.84,69.22 28.57,67.94 28.57,58.42 U102.14
N$13
  Bottom 0.406: U102.4 31.75,50.8 30.48,52.07 20.32,52.07 R168.1
N$14
  Bottom 0.406: R146.2 R402.2 R153.2 82.55,25.4 80.01,27.94 | R146.2 R147.2 R1212.1 | U103.15 27.94,19.05 27.94,27.94 | 27.94,27.94 31.11,31.11 34.92,31.11 R154.2 | 25.4,38.1 25.4,33.02 24.77,32.38 24.77,31.11 27.94,27.94 | R146.2 R143.2 | R145.2 83.82,31.75 80.01,27.94 | 63.5,27.94 61.59,27.94 57.78,24.13 R144.2 53.34,27.94 51.44,29.84 46.35,29.84 38.1,38.1 25.4,38.1 | 63.5,27.94 80.01,27.94 | R142.2 16.51,29.21 18.41,31.11 18.41,36.2 20.32,38.1 25.4,38.1 | 63.5,27.94 R155.2
N$15
  Bottom 0.406: R149.2 21.59,10.16 U103.1
N$16
  Bottom 0.406: R150.2 21.59,8.89 24.77,8.89 25.4,8.89 U103.2
N$17
  Bottom 0.406: R158.2 R159.1 30.48,21.59 30.48,19.05 U103.13
N$18
  Bottom 0.406: 74.93,7.62 IC3.3 | 74.93,7.62 R1110.1 | R1109.2 74.93,7.62
N$19
  Bottom 0.406: R149.1 15.88,5.71 22.23,5.71 R148.3 R148.2
N$20
  Bottom 0.406: R157.1 U103.7
N$21
  Bottom 0.406: R154.1 44.45,27.94 44.45,7.62 43.18,6.35 40.64,6.35 R157.2
N$22
  Bottom 0.406: C114.1 20.32,25.4 R158.1
N$23
  Bottom 0.406: R143.1 87.63,13.97 C109.1
N$24
  Bottom 0.406: U103.14 29.21,26.67 32.38,29.84 33.66,29.84 38.1,25.4 R156.2
N$25  (via drill 0.6)
  other vias: 12.7,77.47
N$26
  Bottom 0.406: R1111.2 R1111.3 76.83,3.17 71.12,3.17 69.22,5.08 R1110.2
N$27
  Bottom 0.406: U103.9 C115.1
N$28
  Bottom 0.406: U103.11 36.83,20.32 C113.1
N$29  (via drill 3.2)
  other vias: 19.05,76.2
N$30
  Bottom 0.406: R140.2 63.5,21.59 R144.1
N$31
  Bottom 0.406: R145.1 88.9,41.91 88.9,59.69 | 88.9,59.69 R127.1 | 88.9,59.69 D101.A D102.C
N$32  (via drill 3.2)
  other vias: 60.96,76.2
N$33  (via drill 3.2)
  other vias: 3.81,3.81
N$34
  Bottom 0.406: U102.5 35.56,48.26 38.1,48.26 38.1,45.72 40.01,43.81 43.81,43.81 47.62,47.62 47.62,48.9 U104.14 52.07,55.88 | C118.2 52.07,57.15 52.07,55.88 | 52.07,55.88 R170.2
N$35  (via drill 3.2)
  other vias: 86.36,3.81
N$36
  Bottom 0.406: R166.2 81.28,53.34 76.2,53.34 73.66,50.8 57.15,50.8 U104.13 54.61,55.88 | R169.2 52.07,63.5 54.61,60.96 C118.1 54.61,55.88 | 54.61,55.88 R170.1
N$38
  Bottom 0.406: R185.2 82.55,49.53 80.64,51.44 76.83,51.44 74.93,49.53 58.42,49.53 U104.2 54.61,40.64 | 54.61,40.64 R178.1 | C119.1 54.61,36.83 | 54.61,36.83 54.61,40.64 | 54.61,36.83 R86.2
N$39  (via drill 0.7)
  Top 0.406: v50.16,27.94 50.16,34.92 C119.2
  Bottom 0.406: U103.5 35.56,8.89 38.1,8.89 38.1,6.35 39.37,5.08 43.81,5.08 45.72,6.99 45.72,26.04 50.16,26.04 v50.16,27.94 | U104.1 52.07,44.45 48.26,40.64 | 48.26,40.64 R178.2 | C119.2 48.26,40.64
N$40
  Bottom 0.406: 67.31,39.37 67.31,43.18 | 67.31,43.18 U104.7 | 67.31,39.37 C116.2 | 67.31,43.18 R73.2 | R155.1 64.77,36.83 67.31,39.37
N$43
  Bottom 0.406: R120.2 58.42,67.31 R124.1
N$46
  Bottom 0.406: U104.8 67.31,55.88 | 67.31,55.88 67.31,58.42 C117.2 R133.1 | 67.31,55.88 R167.2
N$52
  Bottom 0.406: R188.2 21.59,53.34 41.91,53.34 43.18,54.61 43.18,63.5 R138.1 40.64,64.77 39.37,66.04 Q1.2
N$54
  Bottom 0.406: 35.56,62.23 35.56,55.88 36.83,54.61 38.1,54.61 39.37,55.88 U102.10 | 35.56,62.23 R338.1 | 35.56,62.23 Q1.3
N$61
  Bottom 0.406: C122.1 R188.1
N$64
  Bottom 0.406: R196.1 36.2,22.23 40.64,22.23 40.64,19.05 U103.10
OSC_A_0V
  Bottom 0.406: OSC_A_FREQ_OCT.3 77.47,73.66 R161.1
OSC_A_-1V
  Bottom 0.406: R162.1 OSC_A_FREQ_OCT.4
OSC_A_-2V
  Bottom 0.406: OSC_A_FREQ_OCT.5 72.39,73.66 R163.1 R164.1
OSC_A_FREQ
  Bottom 0.406: R131.1 OSC_A_FREQ_OCT.1
OSC_A_OCTAVE
  Top 0.406: OSC_A_FREQ_OCT.6 66.67,74.93 65.41,73.66 65.41,61.59 C117.1
  Bottom 0.406: C117.1 64.77,58.42 64.77,55.88 | U104.9 64.77,55.88 | 64.77,55.88 R167.1
OSC_A_PW
  Bottom 0.406: R169.1 50.8,78.74 10.16,78.74 OSC_A_PW.2
OSC_A_SAW
  Bottom 0.406: OSC_A_WF.1 30.48,76.2 40.64,76.2 44.45,72.39 44.45,52.07 U102.8
OSC_A_SQR
  Bottom 0.406: OSC_A_WF.3 19.05,68.58 R168.2 R177.2
OSC_A_SYNC
  Bottom 0.406: C122.2 5.08,60.96 SYNC.2
OSC_A_TRI
  Bottom 0.406: 26.67,72.39 OSC_A_WF.2 | R337.2 26.67,72.39 | 26.67,72.39 R338.2
OSC_B_0V
  Bottom 0.406: OSC_B_FREQ_OCT.2 77.47,34.29 R184.1
OSC_B_-1V
  Bottom 0.406: R176.1 OSC_B_FREQ_OCT.3
OSC_B_-2V
  Bottom 0.406: OSC_B_FREQ_OCT.4 72.39,34.29 R175.1 R174.1
OSC_B_FREQ
  Bottom 0.406: R153.1 OSC_B_FREQ_OCT.1 80.01,36.83 78.74,38.1 78.74,40.01 74.3,44.45 C110.1
OSC_B_KYBD
  Bottom 0.406: R142.1 OSC_B_KYBD.2
OSC_B_OCTAVE
  Bottom 0.406: 64.77,43.18 64.77,40.64 C116.1 61.59,37.47 61.59,36.2 62.87,34.92 69.22,34.92 OSC_B_FREQ_OCT.5 | 64.77,43.18 U104.6 | 64.77,43.18 R73.1
OSC_B_PW
  Bottom 0.406: R86.1 52.7,31.11 47.62,31.11 38.73,40.01 17.14,40.01 OSC_B_PW.2
OSC_B_SAW
  Top 0.406: SYNC.1 1.27,73.66 1.27,20.95 8.89,13.34 22.23,13.34 22.86,12.7 39.37,12.7 U103.8
  Bottom 0.406: U103.8 43.18,11.43 43.18,30.48 38.1,35.56 OSC_B_WF.1
OSC_B_SQR
  Bottom 0.406: U103.4 31.75,11.43 29.21,13.97 15.88,13.97 14.61,15.24 R199.2 10.16,20.95 24.13,34.92 OSC_B_WF.3
OSC_B_TRI
  Bottom 0.406: 26.67,33.02 OSC_B_WF.2 | R197.2 26.67,33.02 | 26.67,33.02 R196.2
PITCH_BOTTOM
  Bottom 0.406: PITCH_WHEEL_IN.1 96.52,67.31 95.25,68.58 95.25,74.93 R117.1
PITCH_CENTER
  Bottom 0.406: D101.C D102.A 91.44,66.67 94.61,63.5 PITCH_WHEEL_IN.2
PITCH_TOP
  Top 0.406: PITCH_WHEEL_IN.3 94.61,60.96 93.34,62.23 93.34,70.48 96.52,73.66 R118.1

### Text on the board
tPlace: Pro-one rack | Osc board r2 | Tysseng 2012